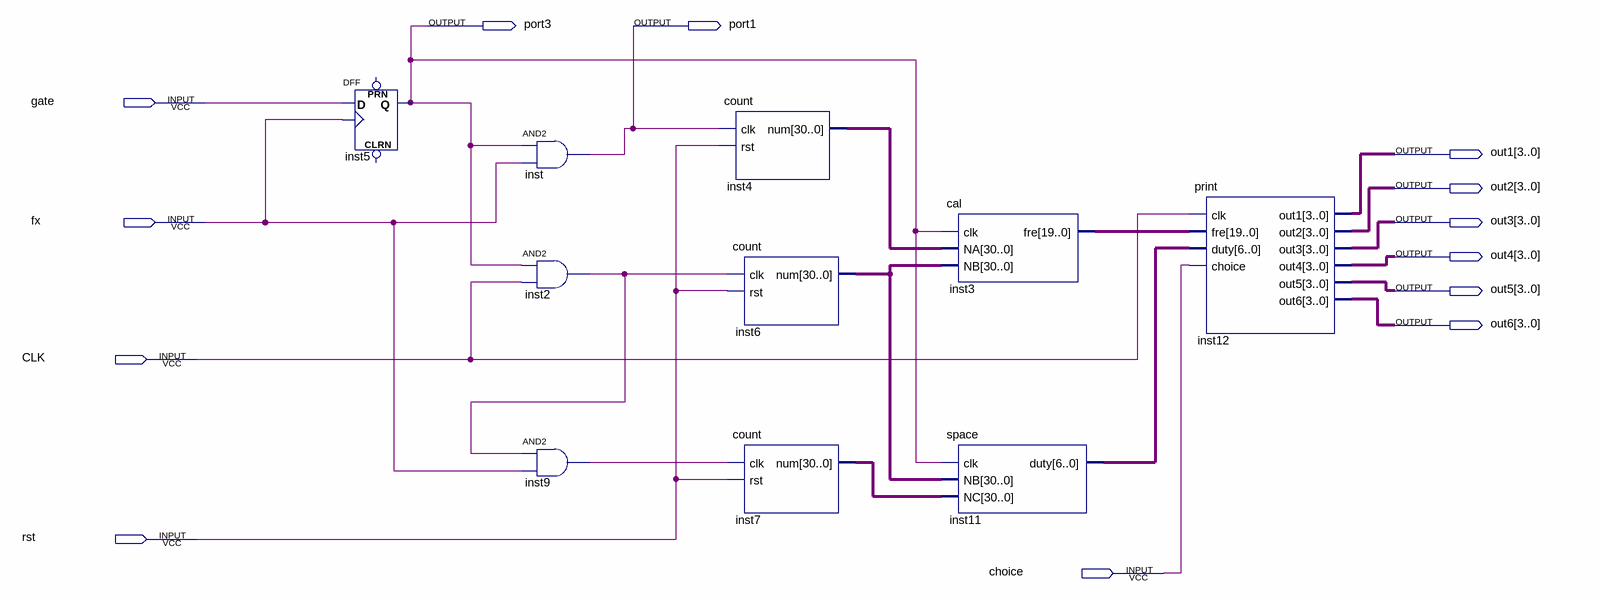
[diagram p0: schematic sheet]
// Quartus schematic test.bdf as structural Verilog: 10 symbols, 13 pins
module test (
  input  gate,
  input  fx,
  input  CLK,
  input  rst,
  input  choice,
  output port3,
  output port1,
  output [3:0] out1,
  output [3:0] out2,
  output [3:0] out3,
  output [3:0] out4,
  output [3:0] out5,
  output [3:0] out6
);

  wire inst2_out, inst9_out;
  wire [6:0] inst11_duty;
  wire [19:0] inst3_fre;
  wire [30:0] inst4_num, inst6_num, inst7_num;

  DFF inst5 (.CLK(fx), .D(gate), .Q(port3));  // open: CLRN, PRN
  and inst (port1, port3, fx);
  and inst2 (inst2_out, port3, CLK);
  and inst9 (inst9_out, inst2_out, fx);
  count inst4 (.clk(port1), .rst(rst), .num(inst4_num));
  count inst6 (.clk(inst2_out), .rst(rst), .num(inst6_num));
  count inst7 (.clk(inst9_out), .rst(rst), .num(inst7_num));
  cal inst3 (.clk(port3), .NA(inst4_num), .NB(inst6_num), .fre(inst3_fre));
  space inst11 (.clk(port3), .NB(inst6_num), .NC(inst7_num), .duty(inst11_duty));
  print inst12 (
    .clk(CLK), .fre(inst3_fre), .duty(inst11_duty), .choice(choice), .out1(out1), .out2(out2), .out3(out3),
    .out4(out4), .out5(out5), .out6(out6));
endmodule
